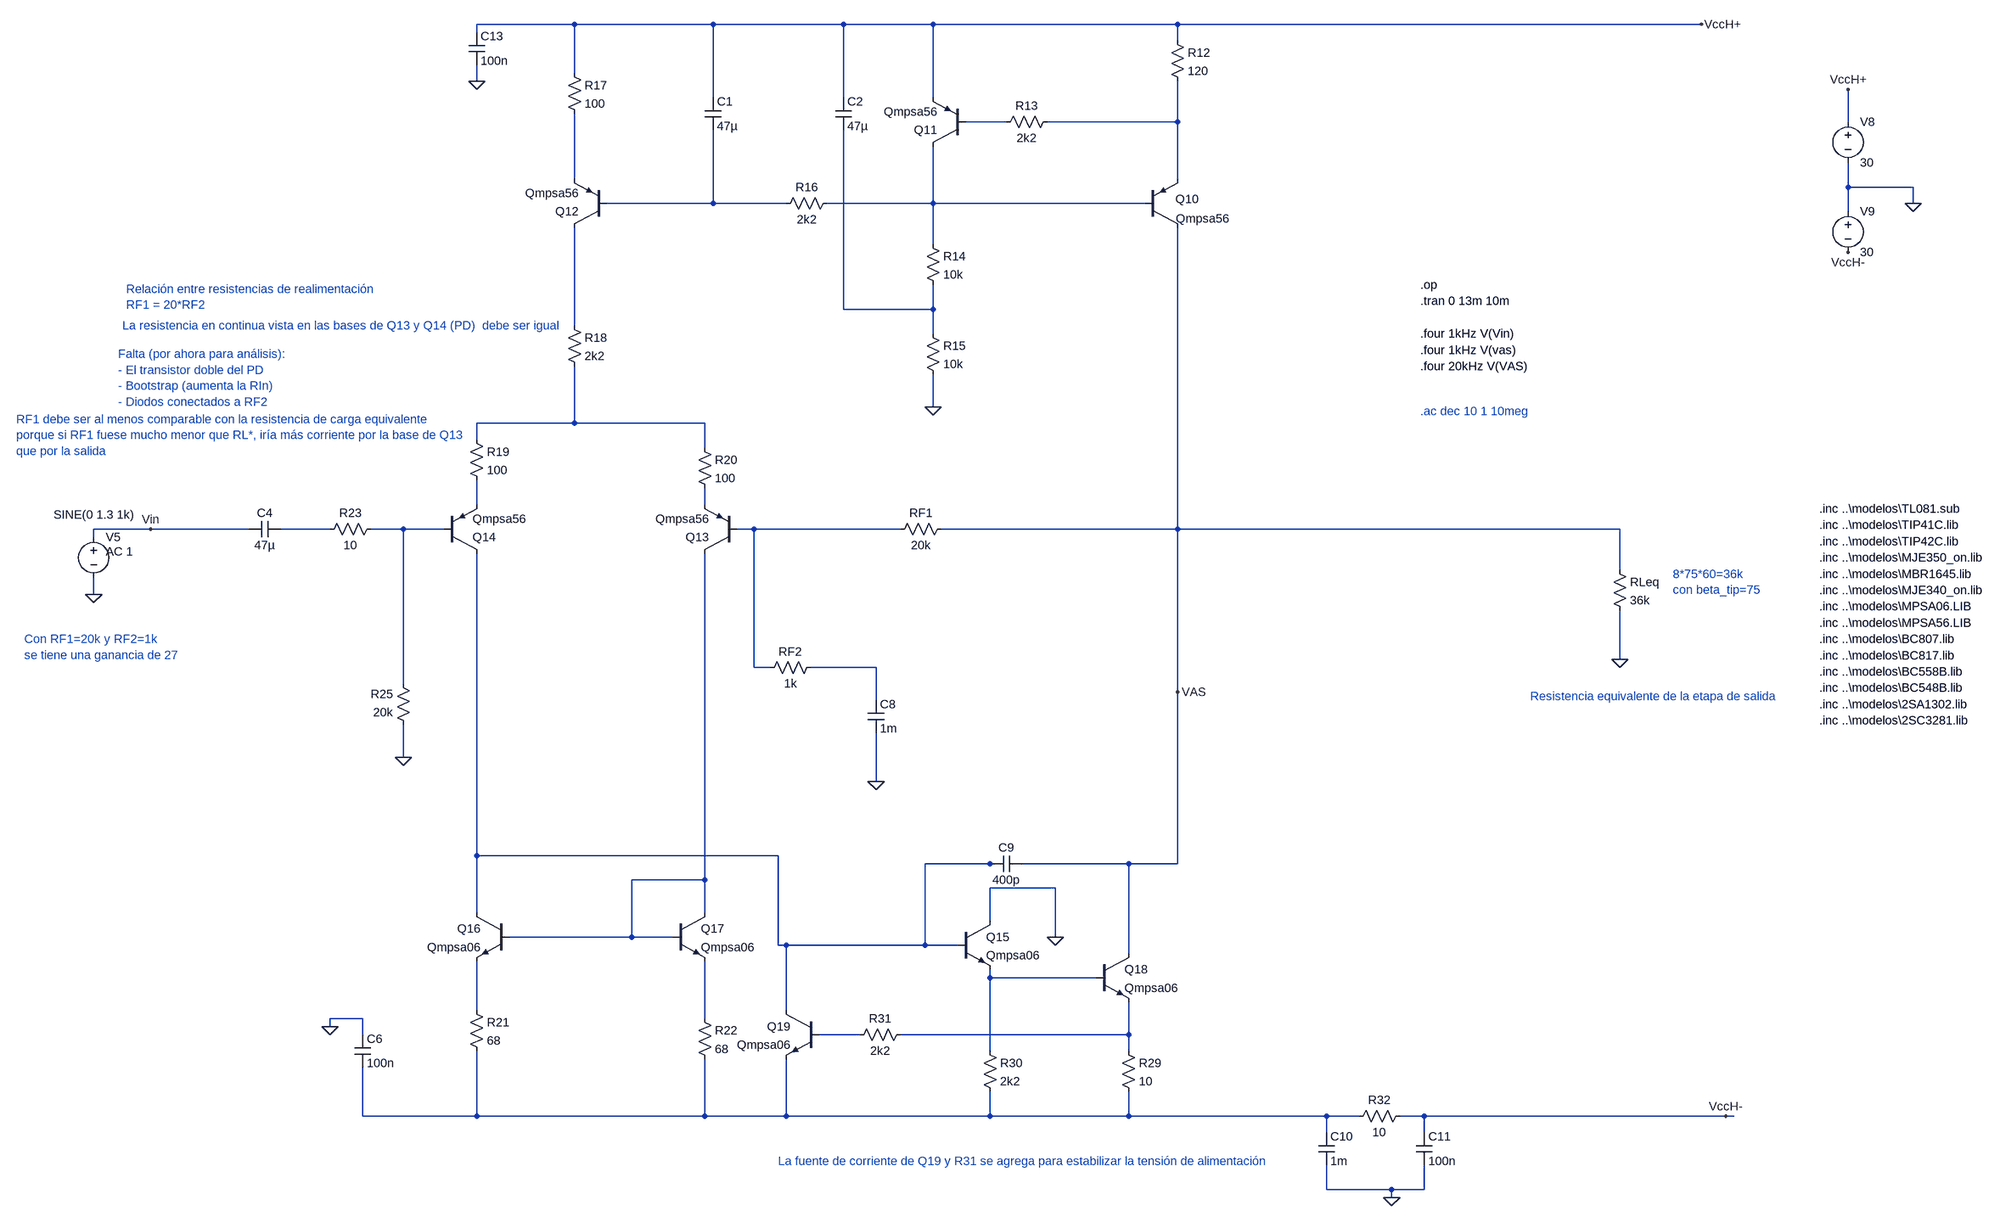
[diagram p0: schematic 2.1_VAS_PD.asc]
2.1_VAS_PD.asc, the LTspice schematic file:
Version 4
SHEET 1 1432 1652
WIRE -1984 -720 -2176 -720
WIRE -1712 -720 -1984 -720
WIRE -1456 -720 -1712 -720
WIRE -1280 -720 -1456 -720
WIRE -800 -720 -1280 -720
WIRE 400 -720 -800 -720
WIRE -2176 -704 -2176 -720
WIRE -800 -688 -800 -720
WIRE -1984 -624 -1984 -720
WIRE -2176 -608 -2176 -640
WIRE -1712 -576 -1712 -720
WIRE -1456 -576 -1456 -720
WIRE -1280 -576 -1280 -720
WIRE -800 -544 -800 -608
WIRE -1136 -528 -1216 -528
WIRE -960 -528 -1056 -528
WIRE -800 -528 -800 -544
WIRE -800 -528 -960 -528
WIRE 688 -528 688 -592
WIRE -1984 -416 -1984 -544
WIRE -800 -416 -800 -528
WIRE 688 -400 688 -448
WIRE 816 -400 688 -400
WIRE -1712 -368 -1712 -512
WIRE -1712 -368 -1920 -368
WIRE -1568 -368 -1712 -368
WIRE -1280 -368 -1280 -480
WIRE -1280 -368 -1488 -368
WIRE -864 -368 -1280 -368
WIRE 816 -368 816 -400
WIRE 688 -352 688 -400
WIRE -1280 -288 -1280 -368
WIRE -1456 -160 -1456 -512
WIRE -1280 -160 -1280 -208
WIRE -1280 -160 -1456 -160
WIRE -1984 -128 -1984 -320
WIRE -1280 -112 -1280 -160
WIRE -1280 32 -1280 -32
WIRE -1984 64 -1984 -48
WIRE -1984 64 -2176 64
WIRE -1728 64 -1984 64
WIRE -2176 96 -2176 64
WIRE -1728 112 -1728 64
WIRE -2176 224 -2176 176
WIRE -1728 224 -1728 192
WIRE -2816 272 -2928 272
WIRE -2624 272 -2816 272
WIRE -2464 272 -2560 272
WIRE -2320 272 -2384 272
WIRE -2240 272 -2320 272
WIRE -1632 272 -1664 272
WIRE -1344 272 -1632 272
WIRE -800 272 -800 -320
WIRE -800 272 -1264 272
WIRE 240 272 -800 272
WIRE -2928 288 -2928 272
WIRE 240 352 240 272
WIRE -2928 400 -2928 368
WIRE 240 528 240 432
WIRE -1632 544 -1632 272
WIRE -1600 544 -1632 544
WIRE -1392 544 -1520 544
WIRE -2320 576 -2320 272
WIRE -2176 592 -2176 320
WIRE -800 592 -800 272
WIRE -1392 608 -1392 544
WIRE -1728 624 -1728 320
WIRE -2320 720 -2320 656
WIRE -1392 768 -1392 672
WIRE -2176 960 -2176 592
WIRE -1584 960 -2176 960
WIRE -1168 976 -1296 976
WIRE -1152 976 -1168 976
WIRE -896 976 -1104 976
WIRE -800 976 -800 592
WIRE -800 976 -896 976
WIRE -1728 1008 -1728 624
WIRE -1728 1008 -1872 1008
WIRE -1040 1024 -1168 1024
WIRE -2176 1072 -2176 960
WIRE -1728 1072 -1728 1008
WIRE -1168 1088 -1168 1024
WIRE -1872 1120 -1872 1008
WIRE -1872 1120 -2112 1120
WIRE -1792 1120 -1872 1120
WIRE -1040 1120 -1040 1024
WIRE -1584 1136 -1584 960
WIRE -1568 1136 -1584 1136
WIRE -1296 1136 -1296 976
WIRE -1296 1136 -1568 1136
WIRE -1232 1136 -1296 1136
WIRE -896 1152 -896 976
WIRE -1168 1200 -1168 1184
WIRE -960 1200 -1168 1200
WIRE -2176 1264 -2176 1168
WIRE -1568 1264 -1568 1136
WIRE -2400 1280 -2464 1280
WIRE -1728 1280 -1728 1168
WIRE -2464 1296 -2464 1280
WIRE -2400 1312 -2400 1280
WIRE -1424 1312 -1504 1312
WIRE -896 1312 -896 1248
WIRE -896 1312 -1344 1312
WIRE -1168 1344 -1168 1200
WIRE -896 1344 -896 1312
WIRE -2400 1472 -2400 1376
WIRE -2176 1472 -2176 1344
WIRE -2176 1472 -2400 1472
WIRE -1728 1472 -1728 1360
WIRE -1728 1472 -2176 1472
WIRE -1568 1472 -1568 1360
WIRE -1568 1472 -1728 1472
WIRE -1168 1472 -1168 1424
WIRE -1168 1472 -1568 1472
WIRE -896 1472 -896 1424
WIRE -896 1472 -1168 1472
WIRE -336 1472 -896 1472
WIRE -272 1472 -336 1472
WIRE -144 1472 -192 1472
WIRE 448 1472 -144 1472
WIRE 464 1472 448 1472
WIRE -336 1504 -336 1472
WIRE -144 1504 -144 1472
WIRE -336 1616 -336 1568
WIRE -208 1616 -336 1616
WIRE -144 1616 -144 1568
WIRE -144 1616 -208 1616
WIRE -208 1632 -208 1616
FLAG 240 528 0
FLAG -2928 400 0
FLAG -2816 272 Vin
FLAG 816 -368 0
FLAG 688 -592 VccH+
FLAG 688 -272 VccH-
FLAG 400 -720 VccH+
FLAG 448 1472 VccH-
FLAG -1280 32 0
FLAG -2320 720 0
FLAG -2464 1296 0
FLAG -1392 768 0
FLAG -1040 1120 0
FLAG -208 1632 0
FLAG -800 592 VAS
FLAG -2176 -608 0
DATAFLAG -896 976 ""
DATAFLAG -960 -528 ""
DATAFLAG -800 -544 "I(R12)"
DATAFLAG -1728 624 "Ie(Q13)"
DATAFLAG -2176 592 "Ie(Q14)"
SYMBOL res 224 336 R0
SYMATTR InstName RLeq
SYMATTR Value 36k
SYMBOL voltage -2928 272 R0
WINDOW 3 -79 -28 Left 2
WINDOW 123 24 44 Left 2
WINDOW 39 0 0 Left 2
SYMATTR Value SINE(0 1.3 1k)
SYMATTR Value2 AC 1
SYMATTR InstName V5
SYMBOL voltage 688 -544 R0
WINDOW 123 0 0 Left 2
WINDOW 39 0 0 Left 2
SYMATTR InstName V8
SYMATTR Value 30
SYMBOL voltage 688 -368 R0
WINDOW 123 0 0 Left 2
WINDOW 39 0 0 Left 2
SYMATTR InstName V9
SYMATTR Value 30
SYMBOL pnp -864 -320 M180
WINDOW 0 60 56 Left 2
WINDOW 3 61 18 Left 2
SYMATTR InstName Q10
SYMATTR Value Qmpsa56
SYMBOL res -816 -704 R0
SYMATTR InstName R12
SYMATTR Value 120
SYMBOL res -1040 -544 R90
WINDOW 0 0 56 VBottom 2
WINDOW 3 32 56 VTop 2
SYMATTR InstName R13
SYMATTR Value 2k2
SYMBOL pnp -1216 -480 R180
SYMATTR InstName Q11
SYMATTR Value Qmpsa56
SYMBOL res -1296 -304 R0
SYMATTR InstName R14
SYMATTR Value 10k
SYMBOL res -1296 -128 R0
SYMATTR InstName R15
SYMATTR Value 10k
SYMBOL res -1472 -384 R90
WINDOW 0 0 56 VBottom 2
WINDOW 3 32 56 VTop 2
SYMATTR InstName R16
SYMATTR Value 2k2
SYMBOL cap -1728 -576 R0
SYMATTR InstName C1
SYMATTR Value 47µ
SYMBOL cap -1472 -576 R0
SYMATTR InstName C2
SYMATTR Value 47µ
SYMBOL res -2000 -640 R0
SYMATTR InstName R17
SYMATTR Value 100
SYMBOL pnp -1920 -320 R180
SYMATTR InstName Q12
SYMATTR Value Qmpsa56
SYMBOL res -2000 -144 R0
SYMATTR InstName R18
SYMATTR Value 2k2
SYMBOL res -2192 80 R0
SYMATTR InstName R19
SYMATTR Value 100
SYMBOL res -1744 96 R0
SYMATTR InstName R20
SYMATTR Value 100
SYMBOL pnp -1664 320 R180
SYMATTR InstName Q13
SYMATTR Value Qmpsa56
SYMBOL pnp -2240 320 M180
SYMATTR InstName Q14
SYMATTR Value Qmpsa56
SYMBOL res -2192 1248 R0
SYMATTR InstName R21
SYMATTR Value 68
SYMBOL res -1744 1264 R0
SYMATTR InstName R22
SYMATTR Value 68
SYMBOL cap -2560 256 R90
WINDOW 0 0 32 VBottom 2
WINDOW 3 32 32 VTop 2
SYMATTR InstName C4
SYMATTR Value 47µ
SYMBOL res -2368 256 R90
WINDOW 0 0 56 VBottom 2
WINDOW 3 32 56 VTop 2
SYMATTR InstName R23
SYMATTR Value 10
SYMBOL res -2304 672 R180
WINDOW 0 36 76 Left 2
WINDOW 3 36 40 Left 2
SYMATTR InstName R25
SYMATTR Value 20k
SYMBOL cap -2416 1312 R0
SYMATTR InstName C6
SYMATTR Value 100n
SYMBOL res -1504 528 R90
WINDOW 0 0 56 VBottom 2
WINDOW 3 32 56 VTop 2
SYMATTR InstName RF2
SYMATTR Value 1k
SYMBOL cap -1408 608 R0
SYMATTR InstName C8
SYMATTR Value 1m
SYMBOL npn -1792 1072 R0
SYMATTR InstName Q17
SYMATTR Value Qmpsa06
SYMBOL npn -2112 1072 M0
SYMATTR InstName Q16
SYMATTR Value Qmpsa06
SYMBOL npn -1232 1088 R0
SYMATTR InstName Q15
SYMATTR Value Qmpsa06
SYMBOL npn -960 1152 R0
SYMATTR InstName Q18
SYMATTR Value Qmpsa06
SYMBOL res -912 1328 R0
SYMATTR InstName R29
SYMATTR Value 10
SYMBOL cap -1104 960 R90
WINDOW 0 0 32 VBottom 2
WINDOW 3 32 32 VTop 2
SYMATTR InstName C9
SYMATTR Value 400p
SYMBOL res -1184 1328 R0
SYMATTR InstName R30
SYMATTR Value 2k2
SYMBOL res -1328 1296 R90
WINDOW 0 0 56 VBottom 2
WINDOW 3 32 56 VTop 2
SYMATTR InstName R31
SYMATTR Value 2k2
SYMBOL npn -1504 1264 M0
SYMATTR InstName Q19
SYMATTR Value Qmpsa06
SYMBOL res -176 1456 R90
WINDOW 0 0 56 VBottom 2
WINDOW 3 32 56 VTop 2
SYMATTR InstName R32
SYMATTR Value 10
SYMBOL cap -352 1504 R0
SYMATTR InstName C10
SYMATTR Value 1m
SYMBOL cap -160 1504 R0
SYMATTR InstName C11
SYMATTR Value 100n
SYMBOL res -1248 256 R90
WINDOW 0 0 56 VBottom 2
WINDOW 3 32 56 VTop 2
SYMATTR InstName RF1
SYMATTR Value 20k
SYMBOL cap -2192 -704 R0
SYMATTR InstName C13
SYMATTR Value 100n
TEXT -152 -176 Left 2 !.tran 0 13m 10m
TEXT -152 -112 Left 2 !.four 1kHz V(Vin)
TEXT -152 -208 Left 2 !.op
TEXT -152 -80 Left 2 !.four 1kHz V(vas)
TEXT -152 40 Left 2 ;.ac dec 10 1 10meg
TEXT -152 -48 Left 2 !.four 20kHz V(VAS)
TEXT 344 360 Left 2 ;8*75*60=36k\ncon beta_tip=75
TEXT 632 552 Left 2 !.inc ..\\modelos\\BC558B.lib
TEXT 632 584 Left 2 !.inc ..\\modelos\\BC548B.lib
TEXT 632 488 Left 2 !.inc ..\\modelos\\BC807.lib
TEXT 632 520 Left 2 !.inc ..\\modelos\\BC817.lib
TEXT 632 616 Left 2 !.inc ..\\modelos\\2SA1302.lib
TEXT 632 648 Left 2 !.inc ..\\modelos\\2SC3281.lib
TEXT 632 424 Left 2 !.inc ..\\modelos\\MPSA06.LIB
TEXT 632 456 Left 2 !.inc ..\\modelos\\MPSA56.LIB
TEXT 632 232 Left 2 !.inc ..\\modelos\\TL081.sub
TEXT 632 264 Left 2 !.inc ..\\modelos\\TIP41C.lib
TEXT 632 296 Left 2 !.inc ..\\modelos\\TIP42C.lib
TEXT 632 392 Left 2 !.inc ..\\modelos\\MJE340_on.lib
TEXT 632 328 Left 2 !.inc ..\\modelos\\MJE350_on.lib
TEXT 632 360 Left 2 !.inc ..\\modelos\\MBR1645.lib
TEXT -2864 -200 Left 2 ;Relación entre resistencias de realimentación\nRF1 = 20*RF2
TEXT -2872 -128 Left 2 ;La resistencia en continua vista en las bases de Q13 y Q14 (PD)  debe ser igual
TEXT -2880 -72 Left 2 ;Falta (por ahora para análisis): \n- El transistor doble del PD\n- Bootstrap (aumenta la RIn)\n- Diodos conectados a RF2
TEXT -3080 56 Left 2 ;RF1 debe ser al menos comparable con la resistencia de carga equivalente\nporque si RF1 fuese mucho menor que RL*, iría más corriente por la base de Q13\nque por la salida
TEXT 64 600 Left 2 ;Resistencia equivalente de la etapa de salida
TEXT -3064 488 Left 2 ;Con RF1=20k y RF2=1k\nse tiene una ganancia de 27
TEXT -1584 1560 Left 2 ;La fuente de corriente de Q19 y R31 se agrega para estabilizar la tensión de alimentación

The netlist it stands for:
* 2.1_VAS_PD.asc
RLeq VAS 0 36k
V5 Vin 0 SINE(0 1.3 1k) AC 1
V8 VccH+ 0 30
V9 0 VccH- 30
Q10 VAS N005 N001 0 Qmpsa56
R12 VccH+ N001 120
R13 N001 N002 2k2
Q11 N005 N002 VccH+ 0 Qmpsa56
R14 N005 N006 10k
R15 N006 0 10k
R16 N005 N004 2k2
C1 VccH+ N004 47µ
C2 VccH+ N006 47µ
R17 VccH+ N003 100
Q12 N007 N004 N003 0 Qmpsa56
R18 N007 N008 2k2
R19 N008 N009 100
R20 N008 N010 100
Q13 N016 N013 N010 0 Qmpsa56
Q14 N015 N012 N009 0 Qmpsa56
R21 N018 N022 68
R22 N019 N022 68
C4 N011 Vin 47µ
R23 N012 N011 10
R25 0 N012 20k
C6 0 N022 100n
RF2 N014 N013 1k
C8 N014 0 1m
Q17 N016 N016 N019 0 Qmpsa06
Q16 N015 N016 N018 0 Qmpsa06
Q15 0 N015 N017 0 Qmpsa06
Q18 VAS N017 N021 0 Qmpsa06
R29 N021 N022 10
C9 VAS N015 400p
R30 N017 N022 2k2
R31 N021 N020 2k2
Q19 N015 N020 N022 0 Qmpsa06
R32 VccH- N022 10
C10 N022 0 1m
C11 VccH- 0 100n
RF1 VAS N013 20k
C13 VccH+ 0 100n
.model NPN NPN
.model PNP PNP
.lib standard.bjt
.tran 0 13m 10m
.four 1kHz V(Vin)
.op
.four 1kHz V(vas)
* .ac dec 10 1 10meg
.four 20kHz V(VAS)
* 8*75*60=36k
* con beta_tip=75
.inc ..\modelos\BC558B.lib
.inc ..\modelos\BC548B.lib
.inc ..\modelos\BC807.lib
.inc ..\modelos\BC817.lib
.inc ..\modelos\2SA1302.lib
.inc ..\modelos\2SC3281.lib
.inc ..\modelos\MPSA06.LIB
.inc ..\modelos\MPSA56.LIB
.inc ..\modelos\TL081.sub
.inc ..\modelos\TIP41C.lib
.inc ..\modelos\TIP42C.lib
.inc ..\modelos\MJE340_on.lib
.inc ..\modelos\MJE350_on.lib
.inc ..\modelos\MBR1645.lib
* Relación entre resistencias de realimentación
* RF1 = 20*RF2
* La resistencia en continua vista en las bases de Q13 y Q14 (PD)  debe ser igual
* Falta (por ahora para análisis):
* - El transistor doble del PD
* - Bootstrap (aumenta la RIn)
* - Diodos conectados a RF2
* RF1 debe ser al menos comparable con la resistencia de carga equivalente
* porque si RF1 fuese mucho menor que RL*, iría más corriente por la base de Q13
* que por la salida
* Resistencia equivalente de la etapa de salida
* Con RF1=20k y RF2=1k
* se tiene una ganancia de 27
* La fuente de corriente de Q19 y R31 se agrega para estabilizar la tensión de alimentación
.backanno
.end